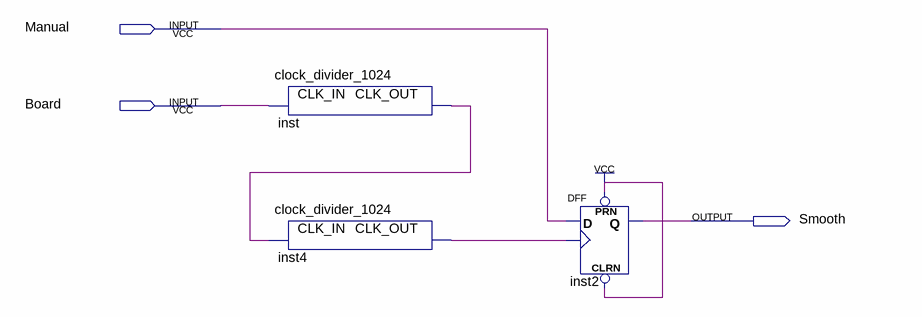
[diagram p0: schematic sheet]
// Quartus schematic debouncer.bdf as structural Verilog: 3 symbols, 3 pins
module debouncer (
  input  Manual,
  input  Board,
  output Smooth
);

  wire inst4_clk_out, inst_clk_out;

  clock_divider_1024 inst (.CLK_IN(Board), .CLK_OUT(inst_clk_out));
  clock_divider_1024 inst4 (.CLK_IN(inst_clk_out), .CLK_OUT(inst4_clk_out));
  DFF inst2 (.CLRN(1'b1), .CLK(inst4_clk_out), .D(Manual), .PRN(1'b1), .Q(Smooth));
endmodule
